# EasyEDA schematic easyeda.json
TITLE: Temperature Sensor; REV: 1.0; Date: 2019-10-31; Sheet: 1/1; Drawn By: Simen Stensås; Company: NTNU
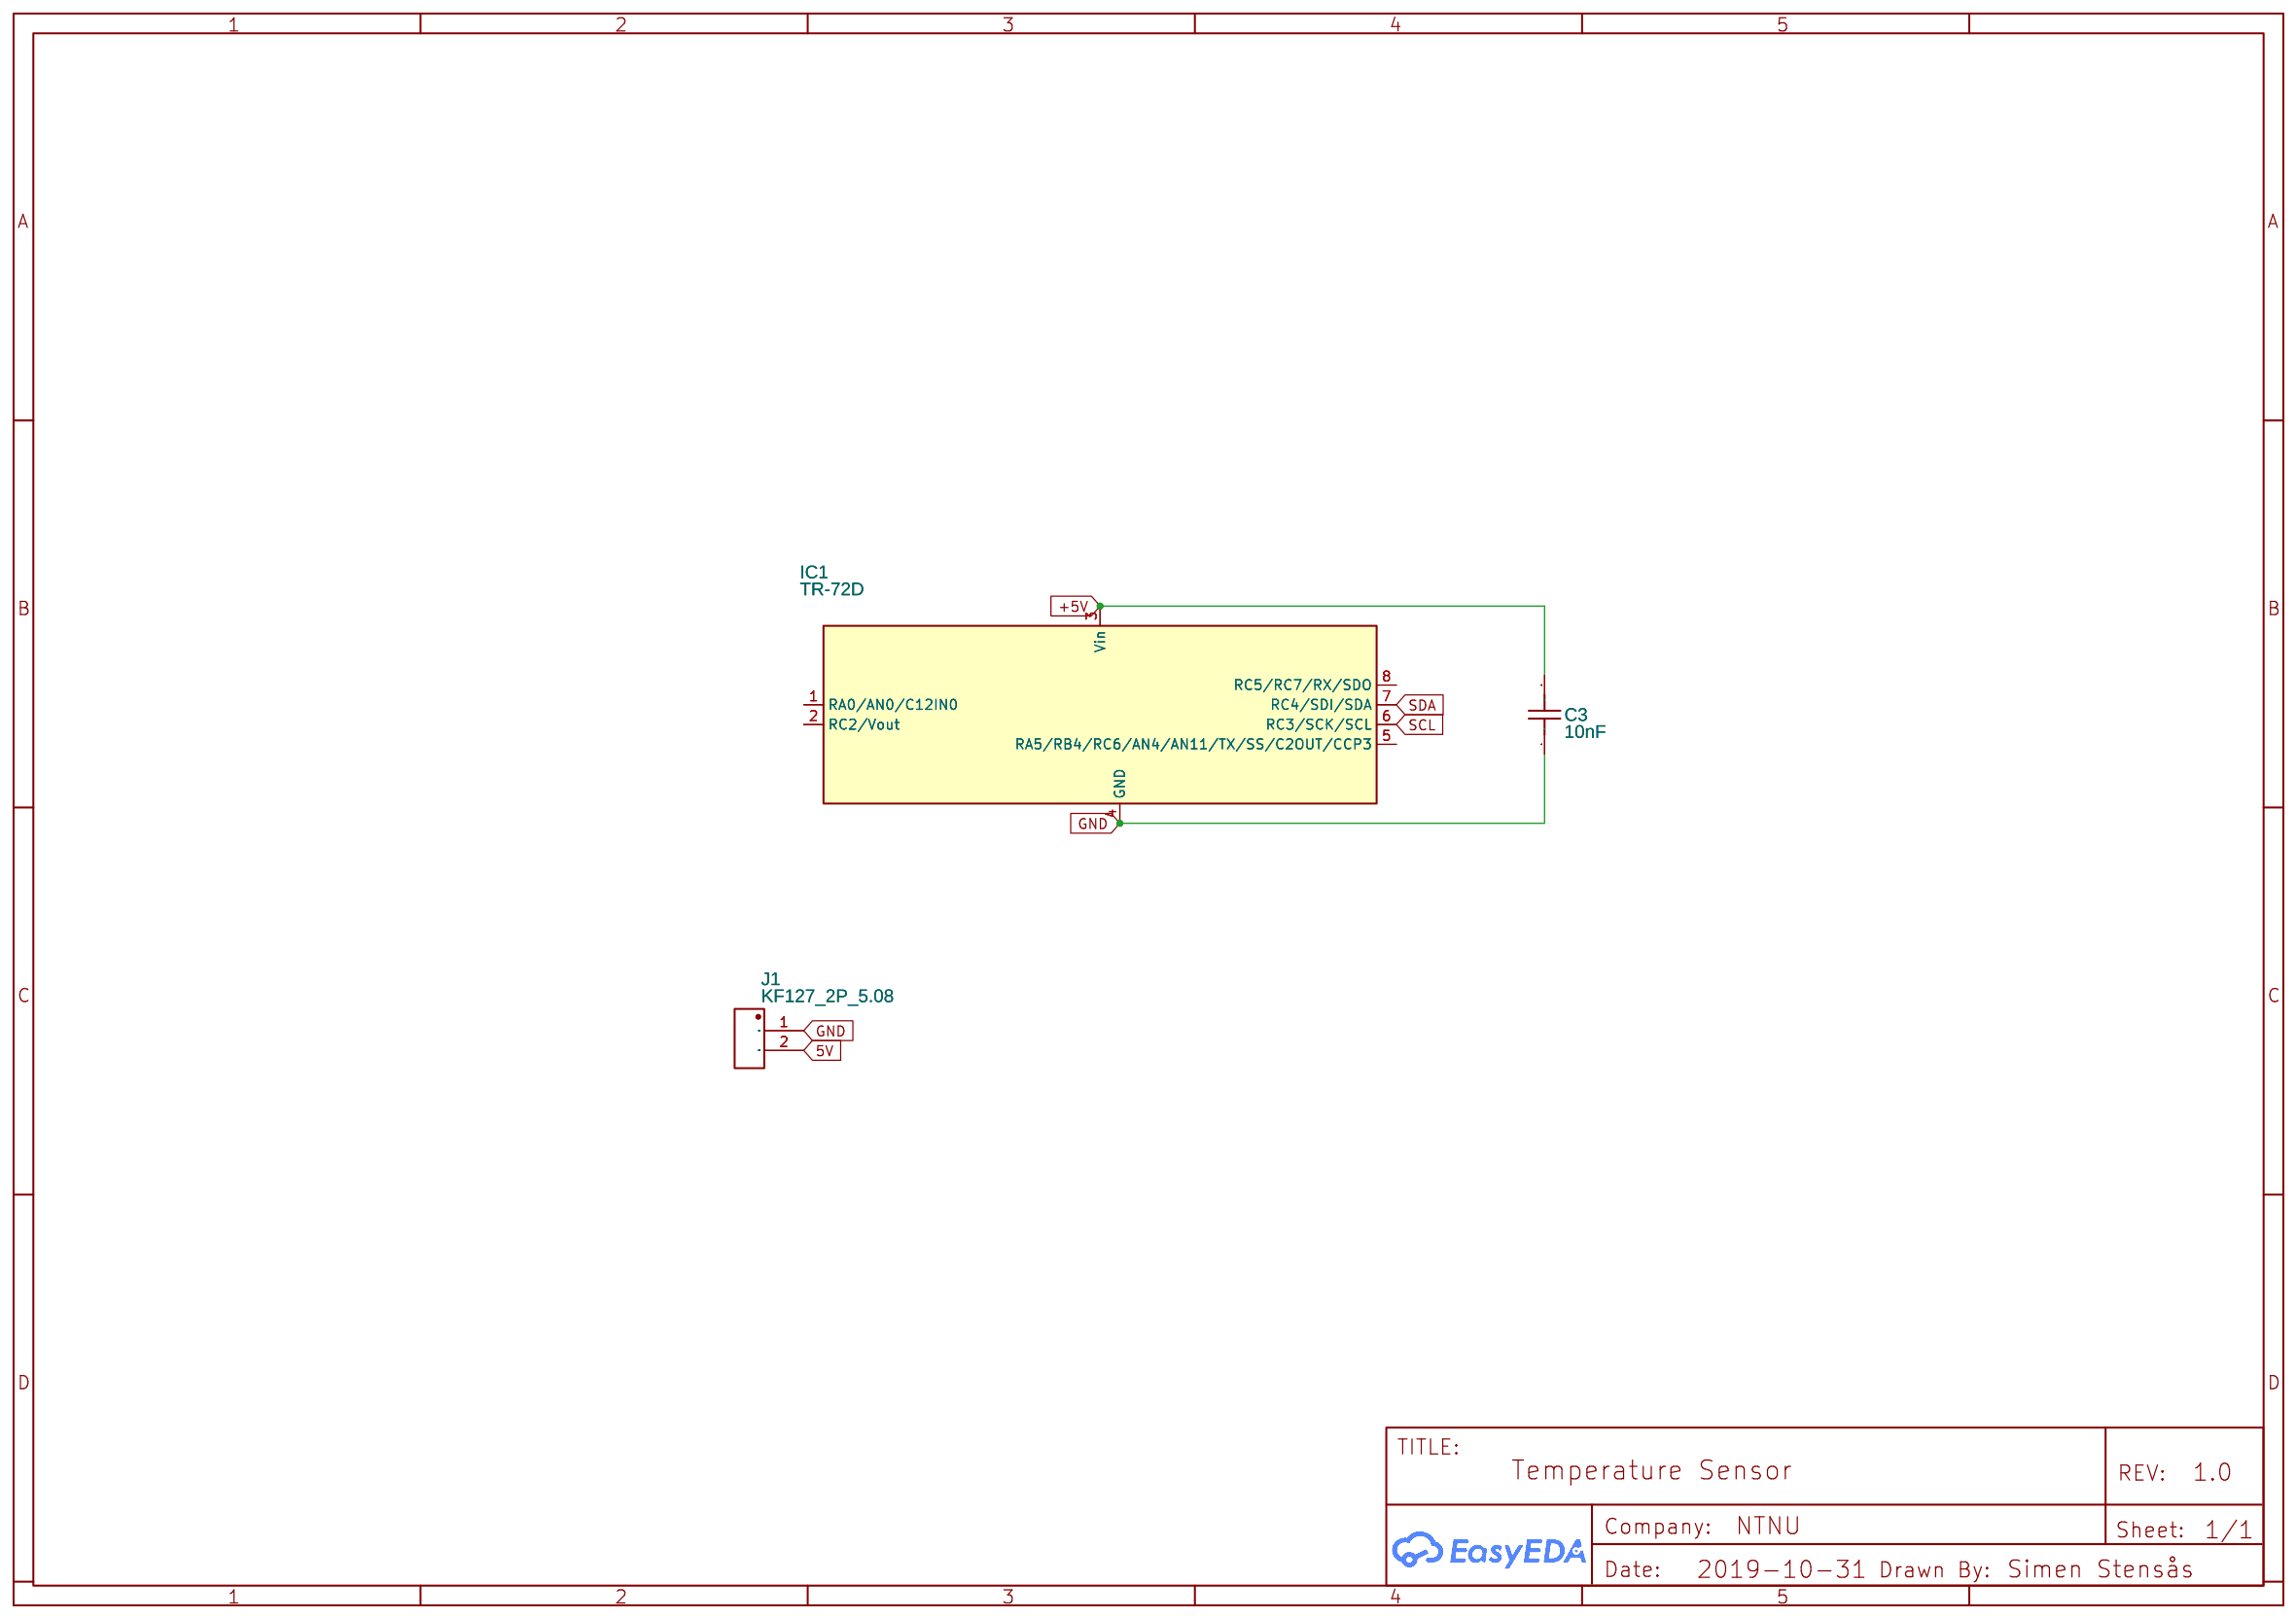
[diagram p0: schematic sheet]

## Parts
C3  10nF  [0603]
IC1  TR-72D  [IQRF_KON-SIM-01]
J1  KF127_2P_5.08  [KF127_2P_5.08]

## Library data of the parts
C3 = 0603B103K500AT: Supplier: LCSC; Supplier Part: C327421; Manufacturer: Guangdong Fenghua Advanced Tech; Contributor: LCSC
IC1 = -: Contributor: Simen Stensas; license: https://www.gnu.org/licenses/lgpl-2.1.html
J1 = -: Manufacturer: Kefa Electronics; Manufacturer Part: KF127L-5.08; Contributor: GrahamG

## Nets
5V: J1.2(PIN2)
+5V: C3.2 IC1.3(Vin)
GND: C3.1 IC1.4(GND) J1.1(PIN1)
SCL: IC1.6(RC3/SCK/SCL)
SDA: IC1.7(RC4/SDI/SDA)

Not connected (* = marked no-connect by the designer): IC1 1(RA0/AN0/C12IN0) 2(RC2/Vout) 5(RA5/RB4/RC6/AN4/AN11/TX/SS/C2OUT/CCP3) 8(RC5/RC7/RX/SDO)
